# EAGLE design momav_power (EAGLE 9.6.1)
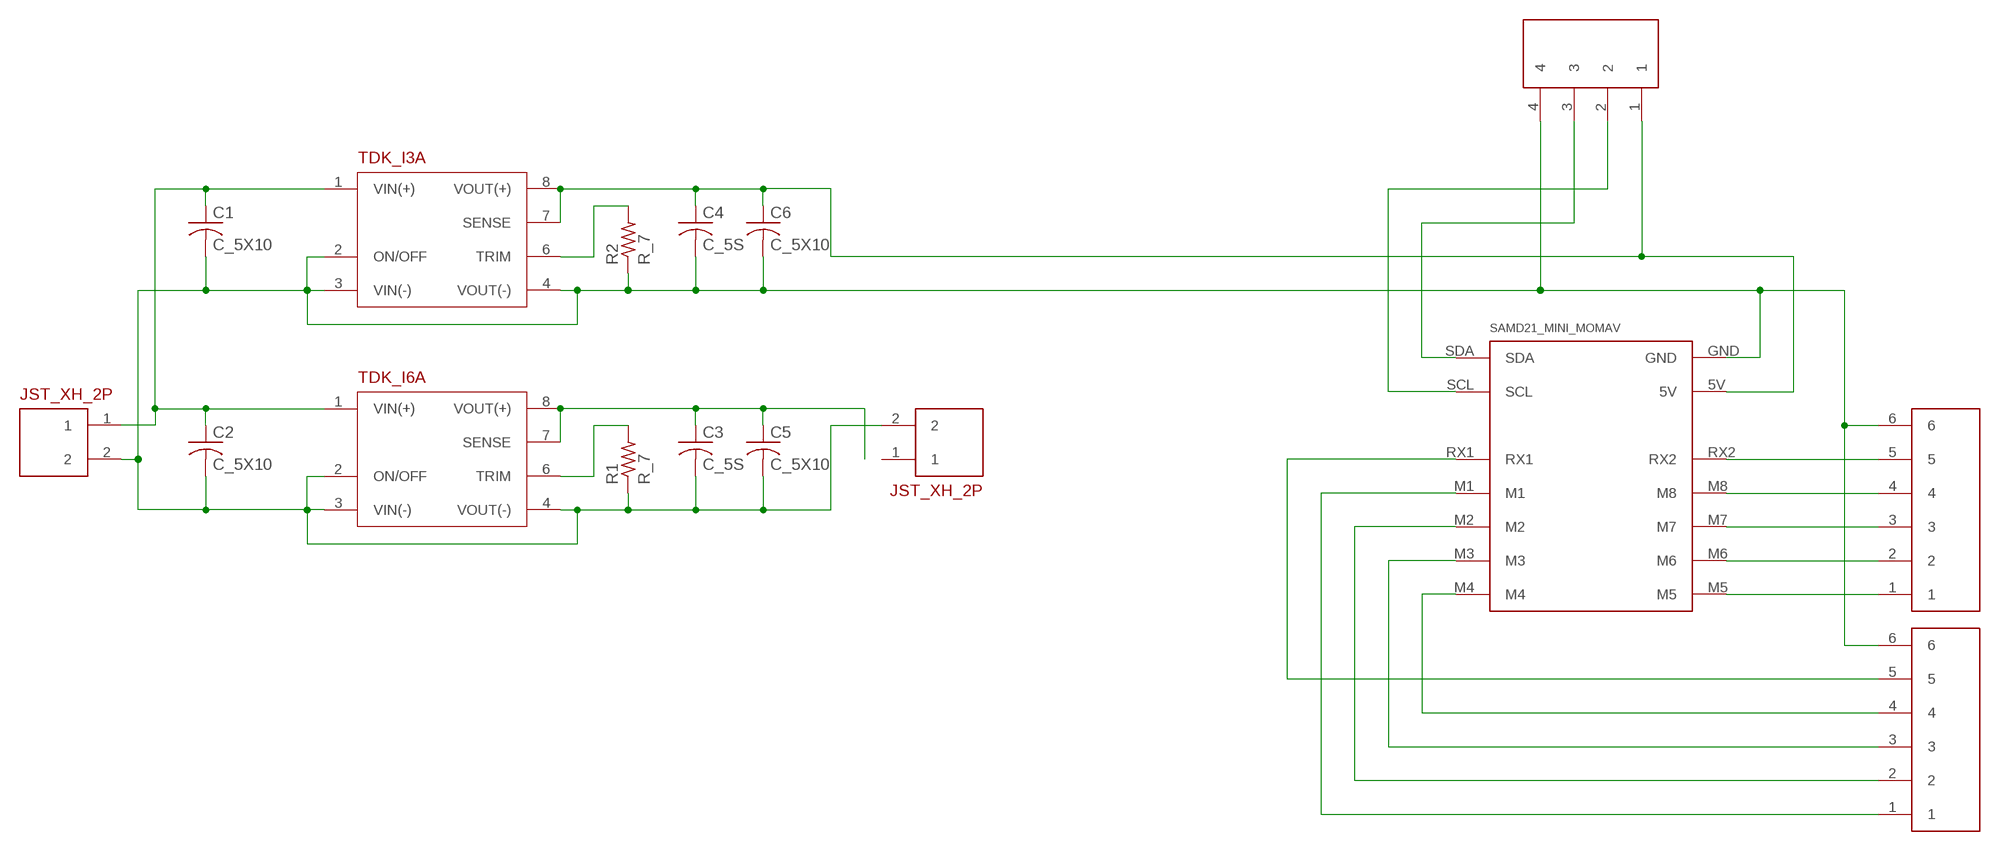
[diagram p0: schematic, sheet 1]

## Parts
C1  C_5X10  [C_5X10]
C2  C_5X10  [C_5X10]
C3  C_5S  [C_5S]
C4  C_5S  [C_5S]
C5  C_5X10  [C_5X10]
C6  C_5X10  [C_5X10]
R1  R_7  [R_7]
R2  R_7  [R_7]
U$1  JST_XH_2P  [JST_XH_2P]
U$2  TDK_I3A  [TDK_I3A]
U$3  TDK_I6A  [TDK_I6A]
U$4  JST_ZH_6P  [JST_ZH_6P]
U$5  JST_XH_2P  [JST_XH_2P]
U$6  JST_ZH_6P  [JST_ZH_6P]
U$7  JST_ZH_4P  [JST_ZH_4P]
U$8  SAMD21_MINI_MOMAV2  [SAMD21_MINI_MOMAV2]

## Nets
GND: C1.2 C2.2 C3.2 C4.2 C5.2 C6.2 R1.1 R2.1 U$1.2 U$2.2(ON/OFF) U$2.3(VIN(-)) U$2.4(VOUT(-)) U$3.2(ON/OFF) U$3.3(VIN(-)) U$3.4(VOUT(-)) U$4.6 U$5.2 U$6.6 U$7.4 U$8.GND
N$1: C4.1 C6.1 U$2.7(SENSE) U$2.8(VOUT(+)) U$7.1 U$8.5V
N$2: C3.1 C5.1 U$3.7(SENSE) U$3.8(VOUT(+))
N$3: C1.1 C2.1 U$2.1(VIN(+)) U$3.1(VIN(+)) U$5.1
N$4: U$7.3 U$8.SDA
N$5: U$7.2 U$8.SCL
N$6: U$4.4 U$8.M4
N$7: R2.2 U$2.6(TRIM)
N$8: R1.2 U$3.6(TRIM)
N$9: U$4.3 U$8.M3
N$10: U$4.2 U$8.M2
N$11: U$4.1 U$8.M1
N$12: U$6.1 U$8.M5
N$13: U$6.2 U$8.M6
N$14: U$6.3 U$8.M7
N$15: U$6.4 U$8.M8
N$16: U$6.5 U$8.RX2
N$17: U$4.5 U$8.RX1
Unconnected: U$1.1

## Library data of the parts
C1 C2 C5 C6 = _custom:C_5X10
C3 C4 = _custom:C_5S
R1 R2 = _custom:R_7
U$1 U$5 = _custom:JST_XH_2P
U$2 = _custom:TDK_I3A
U$3 = _custom:TDK_I6A
U$4 U$6 = _custom:JST_ZH_6P
U$7 = _custom:JST_ZH_4P
U$8 = _custom:SAMD21_MINI_MOMAV2

## Board
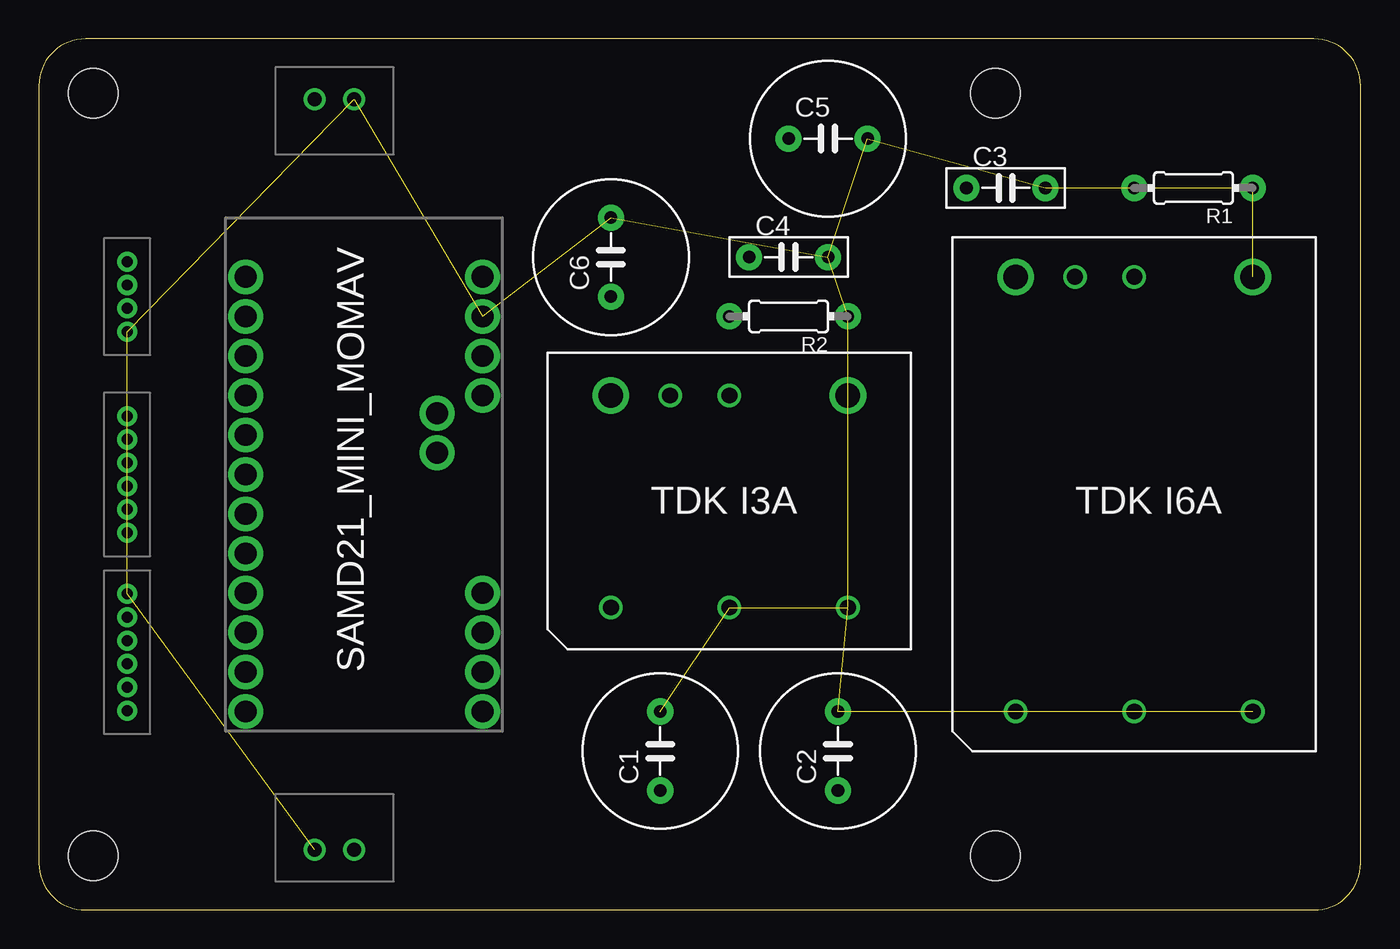
[diagram p1: board, top side]
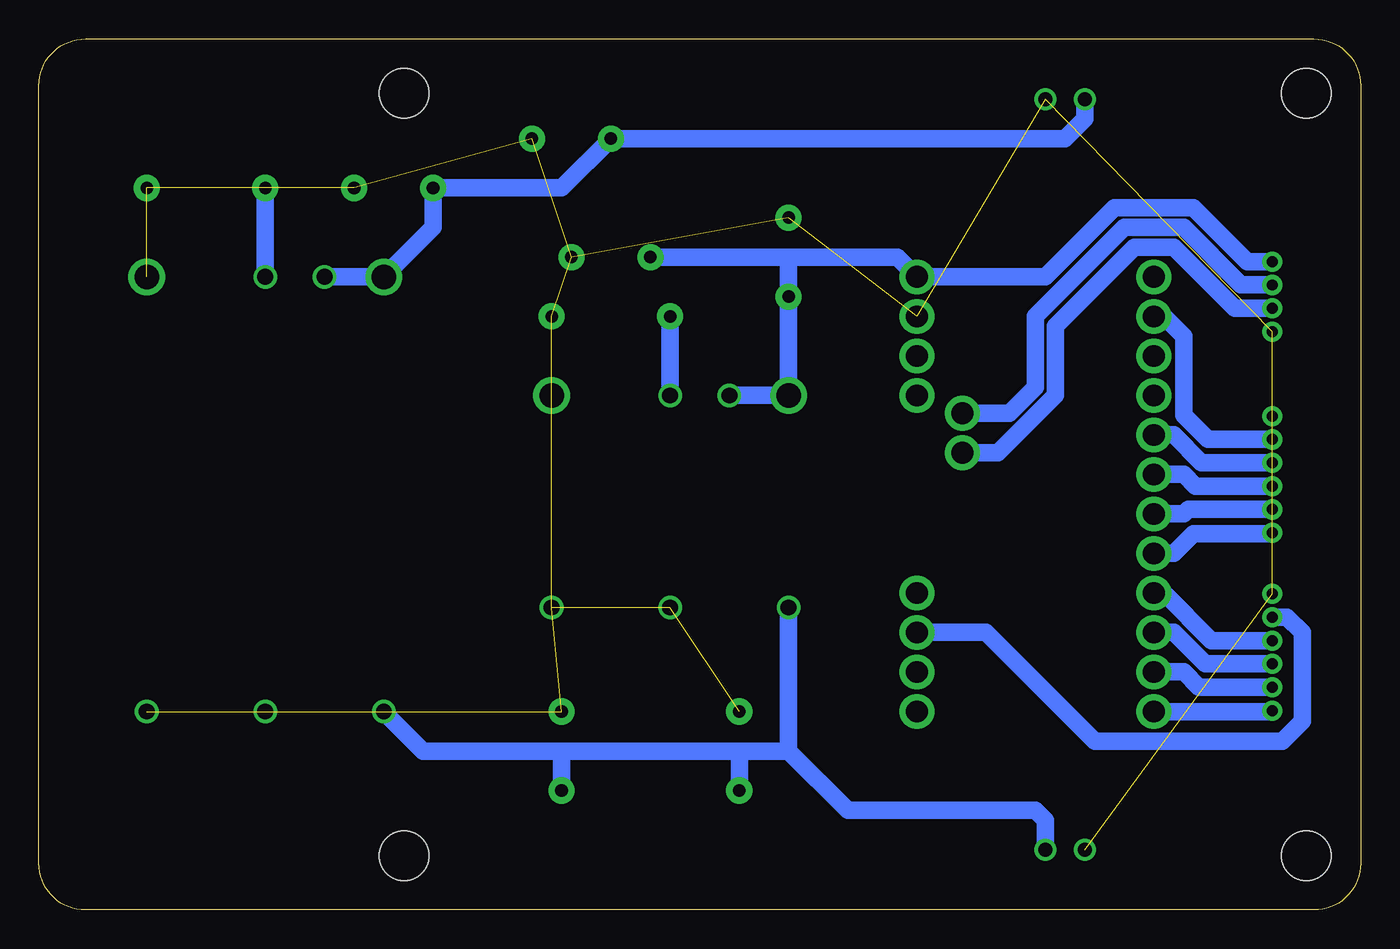
[diagram p2: board, bottom side, seen from below]

Size 85 x 56 mm. Coordinates in mm from the lower left corner, seen from the top.
Outline: 0,53 0,3 arc90 3,0 82,0 arc90 85,3 85,53 arc90 82,56 3,56 arc90 0,53
Copper layers (1*16): Top 0.035mm / dielectric 1.5mm / Bottom 0.035mm
Design rules "default": minimum track width 6mil, minimum drill 0.35mm, track to track 6mil, track to pad 6mil, pad to pad 6mil, via to via 6mil, smd to smd 6mil, copper to edge 40mil, drill to drill 6mil, minimum pad ring 10mil, minimum via ring 8mil, stop-mask expansion 4mil, vias tented up to drill 0mil, thermal gap 10mil
Holes 3.17 mm at 3.5,52.5 61.5,52.5 61.5,3.5 3.5,3.5

### Footprints (pad centres in the part's own frame; a part is rotated, then mirrored left to right if it is on the bottom)
C_5X10 = drill 0.813 pad 1.676: 1 -2.54,0; 2 2.54,0
C_5S = drill 0.813 pad 1.676: 1 -2.54,0; 2 2.54,0
R_7 = drill 0.813 pad 1.676: 1 -3.81,0; 2 3.81,0
JST_XH_2P = drill 0.9: 1 -1.27,0; 2 1.27,0
TDK_I3A = drill 1.016: 1 0,-13.64; 2 7.62,-13.64; 3 15.24,-13.64; 6 7.62,0; 7 3.81,0 | drill 1.575: 4 15.24,0; 8 0,0
TDK_I6A = drill 1.016: 1 0,-27.94; 2 7.62,-27.94; 3 15.24,-27.94; 6 7.62,0; 7 3.81,0 | drill 1.575: 4 15.24,0; 8 0,0
JST_ZH_6P = drill 0.7 pad 1.295: 1 -3.75,0; 2 -2.25,0; 3 -0.75,0; 4 0.75,0; 5 2.25,0; 6 3.75,0
JST_ZH_4P = drill 0.7 pad 1.295: 1 -2.25,0; 2 -0.75,0; 3 0.75,0; 4 2.25,0
SAMD21_MINI_MOMAV2 = drill 1.4 pad 2.235: 5V 12.7,-7.62; GND 10.16,-7.62; M1 -15.24,7.62; M2 -12.7,7.62; M3 -10.16,7.62; M4 -7.62,7.62; M5 -5.08,7.62; M6 -2.54,7.62; M7 0,7.62; M8 2.54,7.62; NC1 5.08,7.62; NC2 7.62,7.62; NC3 12.7,7.62; NC4 -15.24,-7.62; NC5 -12.7,-7.62; NC6 -7.62,-7.62; NC7 5.08,-7.62; NC8 7.62,-7.62; RX1 -10.16,-7.62; RX2 10.16,7.62; SCL 3.937,-4.699; SDA 1.397,-4.699

### Placement (x,y rotation side)
C1  39.96,10.22 90 top
C2  51.39,10.22 90 top
C3  62.18,46.41 0 top
C4  48.21,41.97 0 top
C5  50.75,49.59 0 top
C6  36.78,41.97 90 top
R1  74.25,46.41 180 top
R2  48.21,38.16 180 top
U$1  19,52.13 0 top
U$2  36.78,33.08 0 top
U$3  62.82,40.7 0 top
U$4  5.67,16.57 90 top
U$5  19,3.87 180 top
U$6  5.67,28 90 top
U$7  5.67,39.43 270 top
U$8  20.91,28 90 top

### Tracks (layer width: path | path; a pad name or v marks a point on that pad's centre or on a via)
GND  (19 unrouted)
N$1
  Bottom 1.118: U$2.7 U$2.8 C6.1 36.78,41.97 | 36.78,41.97 29.8,41.97 U$8.5V 20.27,40.7 15.83,45.14 10.75,45.14 7.28,41.68 U$7.1 | C4.1 36.78,41.97
N$2
  Bottom 1.118: U$3.7 U$3.8 59.64,43.87 C3.1 51.39,46.41 C5.1 19,49.59 17.73,50.86 17.73,52.13
N$3
  Bottom 1.118: 36.78,10.22 39.96,10.22 | 39.96,10.22 51.39,10.22 | 51.39,10.22 60.28,10.22 U$3.1 | 39.96,10.22 C1.1 | 51.39,10.22 C2.1 | U$2.1 36.78,10.22 | 36.78,10.22 32.97,6.41 20.91,6.41 20.27,5.77 U$5.1
N$4
  Bottom 1.118: U$7.3 8.09,38.68 12.02,42.6 14.56,42.6 19.64,37.52 19.64,33.08 23.32,29.4 U$8.SDA
N$5
  Bottom 1.118: U$7.2 7.69,40.18 11.38,43.87 15.19,43.87 20.91,38.16 20.91,33.61 22.58,31.94 U$8.SCL
N$6
  Bottom 1.118: U$4.4 9.59,17.32 12.65,20.38 U$8.M4
N$7
  Bottom 1.118: U$2.6 R2.2
N$8
  Bottom 1.118: U$3.6 R1.2
N$9
  Bottom 1.118: U$4.3 10,15.82 12.02,17.84 U$8.M3
N$10
  Bottom 1.118: U$4.2 10.4,14.32 11.38,15.3 U$8.M2
N$11
  Bottom 1.118: U$8.M1 5.73,12.76 U$4.1
N$12
  Bottom 1.118: U$6.1 5.73,24.19 10.75,24.19 12.02,22.92 U$8.M5
N$13
  Bottom 1.118: U$6.2 11.09,25.75 11.38,25.46 U$8.M6
N$14
  Bottom 1.118: U$6.3 10.63,27.25 11.38,28 U$8.M7
N$15
  Bottom 1.118: U$6.4 10.23,28.75 12.02,30.54 U$8.M8
N$16
  Bottom 1.118: U$6.5 9.82,30.25 11.38,31.81 11.38,36.89 12.65,38.16 U$8.RX2
N$17
  Bottom 1.118: U$4.5 4.74,18.82 3.76,17.84 3.76,12.12 5.03,10.85 17.1,10.85 24.08,17.84 U$8.RX1